# Altium schematic sheet Sheet2.SchDoc
size A4; SheetNumber: 1; SheetTotal: 1
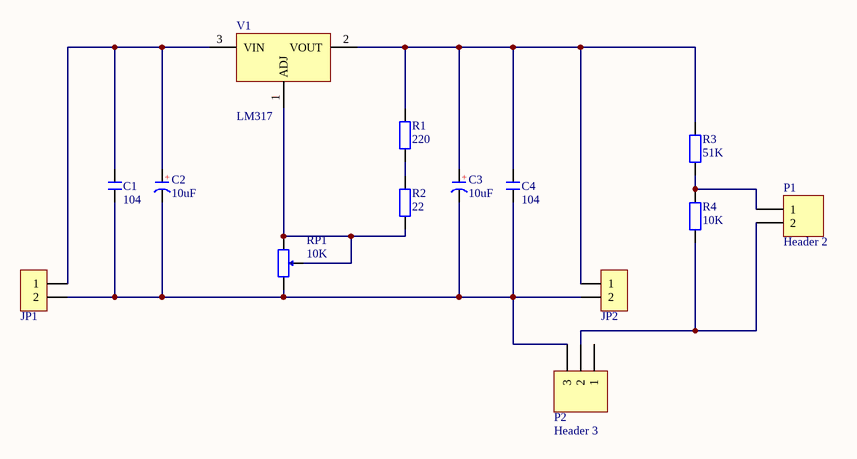
[diagram p0: Sheet2.SchDoc]

## Parts
C1  104  [C 0805_M]
C2  10uF  [CAP 2.0*5*11]
C3  10uF  [CAP 2.0*5*11]
C4  104  [C 0805_M]
JP1  HDR-1X2  [KF2EDGK5.0-LI-2P]  (value not drawn)
JP2  HDR-1X2  [KF2EDGK5.0-LI-2P]  (value not drawn)
P1  Header 2  [HDR1X2]
P2  Header 3  [HDR1X3]
R1  220  [R 0805_M]
R2  22  [R 0805_M]
R3  51K  [R 0805_M]
R4  10K  [R 0805_M]
RP1  10K  [3296W]
V1  LM317  [TO220A]

## Nets
NetC1_1: C1.1 C2.2(K) C3.2(K) C4.1 JP1.2 JP2.2 P2.3 RP1.3
NetC1_2: C1.2 C2.1(A) JP1.1 V1.3(VIN)
NetC3_1: C3.1(A) C4.2 JP2.1 R1.2 R3.2 V1.2(VOUT)
NetP1_1: P1.1 R3.1 R4.2
NetP1_2: P1.2 P2.2 R4.1
NetR1_1: R1.1 R2.2
NetR2_1: R2.1 RP1.1 RP1.2 V1.1(ADJ)

Not connected (* = marked no-connect by the designer): P2 1

## Notes on the sheet
- (in symbol CE) +

## Library data of the parts
C1 C4 = C: 贴片电容; 淘宝ID: 小糖豆的小窝窝; BOM名称: 贴片电容; 下单链接: https://item.taobao.com/item.htm?ft=t&id=613637044352
C2 C3 = CE: 直插电解电容; 淘宝ID: 小糖豆的小窝窝; BOM名称: 直插电解电容; 下单链接: https://item.taobao.com/item.htm?ft=t&id=613637044352
JP1 JP2 = Header 2: 2P接插件; 淘宝ID: 小糖豆的小窝窝; BOM名称: 2P接插件; 下单链接: https://item.taobao.com/item.htm?ft=t&id=613637044352
P1 = Header 2: Header, 2-Pin; LatestRevisionDate: 17-Jul-2002; LatestRevisionNote: Re-released for DXP Platform.; Publisher: Altium Limited
P2 = Header 3: Header, 3-Pin; LatestRevisionDate: 17-Jul-2002; LatestRevisionNote: Re-released for DXP Platform.; Publisher: Altium Limited
R1-R4 = R: 贴片电阻; 淘宝ID: 小糖豆的小窝窝; BOM名称: 贴片电阻; 下单链接: https://item.taobao.com/item.htm?ft=t&id=613637044352
RP1 = RP: 单联电位器; 淘宝ID: 小糖豆的小窝窝; BOM名称: 单联电位器; 下单链接: https://item.taobao.com/item.htm?ft=t&id=613637044352
V1 = LM317: 可调线性稳压芯片; 淘宝ID: 小糖豆的小窝窝; BOM名称: 可调线性稳压芯片; 下单链接: https://item.taobao.com/item.htm?ft=t&id=613637044352